# EasyEDA schematic SCH_CustomESP32Board_2024-06-23.json
TITLE: Sheet_1; REV: 1.0; Date: 2023-11-22; Sheet: 1/1; Drawn By: adammillion2006; Company: Your Company
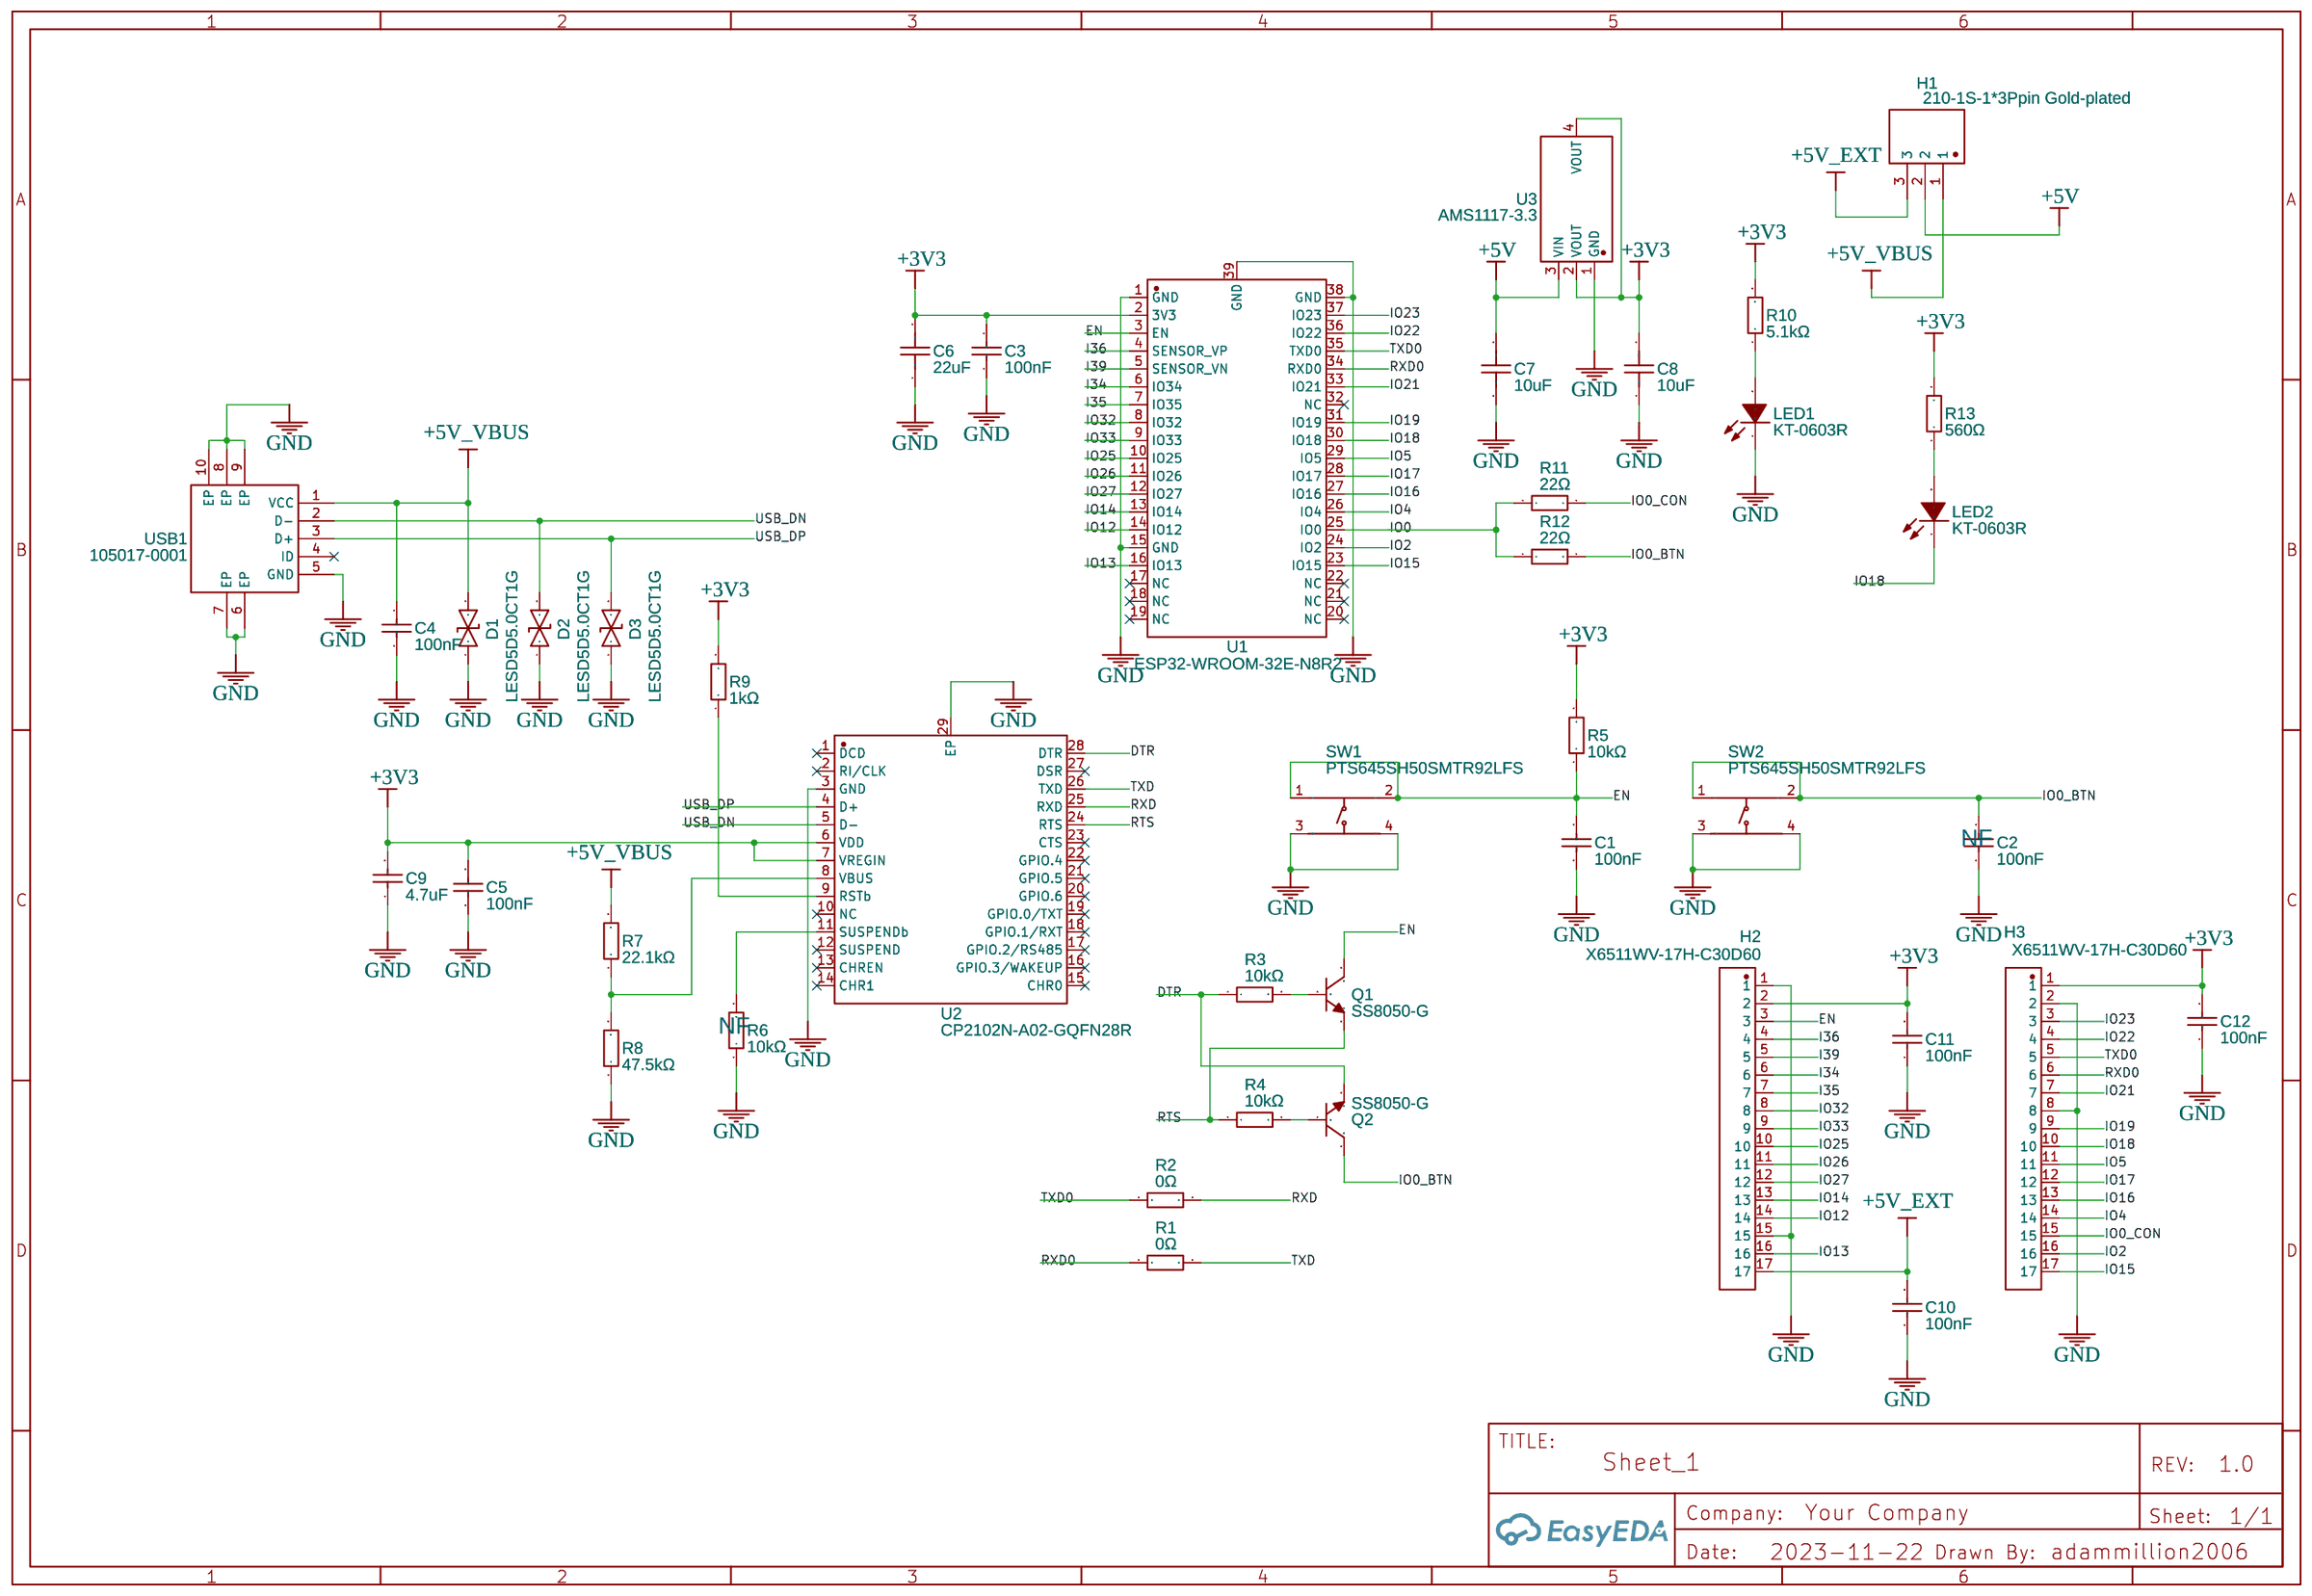
[diagram p0: schematic sheet]

## Parts
C1  100nF  [C0402]
C2  100nF  [C0402]
C3  100nF  [C0402]
C4  100nF  [C0402]
C5  100nF  [C0402]
C6  22uF  [C0805]
C7  10uF  [C0603]
C8  10uF  [C0603]
C9  4.7uF  [C0402]
C10  100nF  [C0402]
C11  100nF  [C0402]
C12  100nF  [C0402]
D1  LESD5D5.0CT1G  [SOD-523_L1.2-W0.8-LS1.6-BI]
D2  LESD5D5.0CT1G  [SOD-523_L1.2-W0.8-LS1.6-BI]
D3  LESD5D5.0CT1G  [SOD-523_L1.2-W0.8-LS1.6-BI]
H1  210-1S-1*3Ppin Gold-plated  [HDR-TH_3P-P1.27-V-M-1]
H2  X6511WV-17H-C30D60  [HDR-TH_17P-P2.54-V-M]
H3  X6511WV-17H-C30D60  [HDR-TH_17P-P2.54-V-M]
LED1  KT-0603R  [LED0603-RD]
LED2  KT-0603R  [LED0603-RD]
Q1  SS8050-G  [SOT-23-3_L2.9-W1.3-P1.90-LS2.4-BR]
Q2  SS8050-G  [SOT-23-3_L2.9-W1.3-P1.90-LS2.4-BR]
R1  0Ω  [R0402]
R2  0Ω  [R0402]
R3  10kΩ  [R0402]
R4  10kΩ  [R0402]
R5  10kΩ  [R0402]
R6  10kΩ  [R0402]
R7  22.1kΩ  [R0402]
R8  47.5kΩ  [R0402]
R9  1kΩ  [R0402]
R10  5.1kΩ  [R0402]
R11  22Ω  [R0402]
R12  22Ω  [R0402]
R13  560Ω  [R0402]
SW1  PTS645SH50SMTR92LFS  [KEY-SMD_4P-L6.0-W6.0-P4.50-LS9.0]
SW2  PTS645SH50SMTR92LFS  [KEY-SMD_4P-L6.0-W6.0-P4.50-LS9.0]
U1  ESP32-WROOM-32E-N8R2  [WIFI-SMD_ESP32-WROOM-32E]
U2  CP2102N-A02-GQFN28R  [QFN-28_L5.0-W5.0-P0.50-TL-EP3.3]
U3  AMS1117-3.3  [SOT-223-3_L6.5-W3.4-P2.30-LS7.0-BR]
USB1  105017-0001  [MICRO-USB-SMD_105017-0001]

## Library data of the parts
C1-C5 C10-C12 = CL05B104KO5NNNC: Supplier: LCSC; Manufacturer: SAMSUNG(三星); Supplier Part: C1525; JLCPCB Part Class: Basic Part; link: https://lcsc.com/eda_search?q=C1525&%26type=1&ref=editor
C6 = CL21A226MAQNNNE: Supplier: LCSC; Manufacturer: SAMSUNG(三星); Supplier Part: C45783; JLCPCB Part Class: Basic Part; link: https://lcsc.com/eda_search?q=C45783&%26type=1&ref=editor
C7 C8 = CL10A106KP8NNNC: Supplier: LCSC; Manufacturer: SAMSUNG(三星); Supplier Part: C19702; JLCPCB Part Class: Basic Part; link: https://lcsc.com/eda_search?q=C19702&%26type=1&ref=editor
C9 = CL05A475MP5NRNC: Supplier: LCSC; Manufacturer: SAMSUNG(三星); Supplier Part: C23733; JLCPCB Part Class: Basic Part; link: https://lcsc.com/eda_search?q=C23733&%26type=1&ref=editor
D1-D3 = LESD5D5.0CT1G: Contributor: LCSC; Supplier: LCSC; Supplier Part: C383211; Manufacturer: LRC(乐山无线电); JLCPCB Part Class: Extended Part; link: https://lcsc.com/eda_search?q=C383211&%26type=1&ref=editor
H1 = 210-1S-1*3Ppin Gold-plated: Contributor: LCSC; Supplier: LCSC; Manufacturer: Ckmtw(灿科盟); Manufacturer Part: B-2101S03P-A110; Supplier Part: C124354; JLCPCB Part Class: Extended Part; link: https://lcsc.com/eda_search?q=C124354&%26type=1&ref=editor
H2 H3 = X6511WV-17H-C30D60: Contributor: LCSC; Supplier: LCSC; Supplier Part: C725949; Manufacturer: XKB Connectivity(中国星坤); Manufacturer Part: X6511WV-17H-C60D30; JLCPCB Part Class: Extended Part; link: https://lcsc.com/eda_search?q=C725949&%26type=1&ref=editor
LED1 LED2 = KT-0603R: Supplier: LCSC; Manufacturer: KENTO; Supplier Part: C2286; JLCPCB Part Class: Basic Part; link: https://lcsc.com/eda_search?q=C2286&%26type=1&ref=editor
Q1 Q2 = SS8050-G: Contributor: LCSC; Supplier: LCSC; Manufacturer: CJ(江苏长电/长晶); Supplier Part: C164886; JLCPCB Part Class: Extended Part; link: https://lcsc.com/eda_search?q=C164886&%26type=1&ref=editor
R1 R2 = 0402WGF0000TCE: Supplier: LCSC; Manufacturer: UNI-ROYAL(厚声); Supplier Part: C17168; JLCPCB Part Class: Basic Part; link: https://lcsc.com/eda_search?q=C17168&%26type=1&ref=editor
R3-R6 = 0402WGF1002TCE: Supplier: LCSC; Manufacturer: UNI-ROYAL(厚声); Supplier Part: C25744; JLCPCB Part Class: Basic Part; link: https://lcsc.com/eda_search?q=C25744&%26type=1&ref=editor
R7 = 0402WGF2212TCE: Supplier: LCSC; Manufacturer: UNI-ROYAL(厚声); Supplier Part: C43473; JLCPCB Part Class: Extended Part; link: https://lcsc.com/eda_search?q=C43473&%26type=1&ref=editor
R8 = 0402WGF4752TCE: Supplier: LCSC; Manufacturer: UNI-ROYAL(厚声); Supplier Part: C25896; JLCPCB Part Class: Extended Part; link: https://lcsc.com/eda_search?q=C25896&%26type=1&ref=editor
R9 = 0402WGF1001TCE: Supplier: LCSC; Manufacturer: UNI-ROYAL(厚声); Supplier Part: C11702; JLCPCB Part Class: Basic Part; link: https://lcsc.com/eda_search?q=C11702&%26type=1&ref=editor
R10 = 0402WGF5101TCE: Supplier: LCSC; Manufacturer: UNI-ROYAL(厚声); Supplier Part: C25905; JLCPCB Part Class: Basic Part; link: https://lcsc.com/eda_search?q=C25905&%26type=1&ref=editor
R11 R12 = 0402WGF220JTCE: Supplier: LCSC; Manufacturer: UNI-ROYAL(厚声); Supplier Part: C25092; JLCPCB Part Class: Basic Part; link: https://lcsc.com/eda_search?q=C25092&%26type=1&ref=editor
R13 = 0402WGF5600TCE: Supplier: LCSC; Manufacturer: UNI-ROYAL(厚声); Supplier Part: C25126; JLCPCB Part Class: Extended Part; link: https://lcsc.com/eda_search?q=C25126&%26type=1&ref=editor
SW1 SW2 = PTS645SH50SMTR92LFS: Contributor: LCSC; Supplier: LCSC; Supplier Part: C221869; Manufacturer: C&K; JLCPCB Part Class: Extended Part; link: https://lcsc.com/eda_search?q=C221869&%26type=1&ref=editor
U1 = ESP32-WROOM-32E-N8R2: Supplier: LCSC; Supplier Part: C5361945; Manufacturer: ESPRESSIF(乐鑫); JLCPCB Part Class: Extended Part; Contributor: lcsc; link: https://lcsc.com/eda_search?q=C5361945&%26type=1&ref=editor
U2 = CP2102N-A02-GQFN28R: Contributor: LCSC; Supplier: LCSC; Supplier Part: C964632; Manufacturer: SILICON LABS(芯科); JLCPCB Part Class: Extended Part; link: https://lcsc.com/eda_search?q=C964632&%26type=1&ref=editor
U3 = AMS1117-3.3: sourceId: dwIGgezVh; Supplier: LCSC; Manufacturer: AMS; Supplier Part: C6186; JLCPCB Part Class: Basic Part; link: https://lcsc.com/eda_search?q=C6186&%26type=1&ref=editor
USB1 = 105017-0001: Contributor: LCSC; Supplier: LCSC; Manufacturer: MOLEX; Manufacturer Part: 1050170001; Supplier Part: C136000; JLCPCB Part Class: Extended Part; link: https://lcsc.com/eda_search?q=C136000&%26type=1&ref=editor

## Nets
+3V3: C3.2 C5.2 C6.2 C8.2 C9.2 C11.2 C12.2 H2.2 H3.1 R5.2 R9.2 R10.2 R13.2 U1.2(3V3) U2.6(VDD) U2.7(VREGIN) U3.2(VOUT) U3.4(VOUT)
+5V: C7.2 H1.2 U3.3(VIN)
+5V_EXT: C10.2 H1.3 H2.17
+5V_VBUS: C4.2 D1.2 H1.1 R7.2 USB1.1(VCC)
GND: C1.1 C2.1 C3.1 C4.1 C5.1 C6.1 C7.1 C8.1 C9.1 C10.1 C11.1 C12.1 D1.1 D2.1 D3.1 H2.1 H2.15 H3.2 H3.8 LED1.1(K) R6.1 R8.1 SW1.3 SW1.4 SW2.3 SW2.4 U1.1(GND) U1.15(GND) U1.38(GND) U1.39(GND) U2.3(GND) U2.29(EP) U3.1(GND) USB1.5(GND) USB1.6(EP) USB1.7(EP) USB1.8(EP) USB1.9(EP) USB1.10(EP)
DTR: Q2.2(E) R3.1 U2.28(DTR)
EN: C1.2 H2.3 Q1.3(C) R5.1 SW1.1 SW1.2 U1.3(EN)
I34: H2.6 U1.6(IO34)
I35: H2.7 U1.7(IO35)
I36: H2.4 U1.4(SENSOR_VP)
I39: H2.5 U1.5(SENSOR_VN)
IO0: R11.1 R12.1 U1.25(IO0)
IO0_BTN: C2.2 Q2.3(C) R12.2 SW2.1 SW2.2
IO0_CON: H3.15 R11.2
IO2: H3.16 U1.24(IO2)
IO4: H3.14 U1.26(IO4)
IO5: H3.11 U1.29(IO5)
IO12: H2.14 U1.14(IO12)
IO13: H2.16 U1.16(IO13)
IO14: H2.13 U1.13(IO14)
IO15: H3.17 U1.23(IO15)
IO16: H3.13 U1.27(IO16)
IO17: H3.12 U1.28(IO17)
IO18: H3.10 LED2.1(K) U1.30(IO18)
IO19: H3.9 U1.31(IO19)
IO21: H3.7 U1.33(IO21)
IO22: H3.4 U1.36(IO22)
IO23: H3.3 U1.37(IO23)
IO25: H2.10 U1.10(IO25)
IO26: H2.11 U1.11(IO26)
IO27: H2.12 U1.12(IO27)
IO32: H2.8 U1.8(IO32)
IO33: H2.9 U1.9(IO33)
RTS: Q1.2(E) R4.1 U2.24(RTS)
RXD: R2.2 U2.25(RXD)
RXD0: H3.6 R1.1 U1.34(RXD0)
TXD: R1.2 U2.26(TXD)
TXD0: H3.5 R2.1 U1.35(TXD0)
USB_DN: D2.2 U2.5(D-) USB1.2(D-)
USB_DP: D3.2 U2.4(D+) USB1.3(D+)
Net-(LED1-2): LED1.2(A) R10.1
Net-(LED2-2): LED2.2(A) R13.1
Net-(Q1-1): Q1.1(B) R3.2
Net-(Q2-1): Q2.1(B) R4.2
Net-(R6-2): R6.2 U2.11(SUSPENDb)
Net-(R7-1): R7.1 R8.2 U2.8(VBUS)
Net-(R9-1): R9.1 U2.9(RSTb)

Not connected (* = marked no-connect by the designer): U1 17(NC)* 18(NC)* 19(NC)* 20(NC)* 21(NC)* 22(NC)* 32(NC)*; U2 1(DCD)* 2(RI/CLK)* 10(NC)* 12(SUSPEND)* 13(CHREN)* 14(CHR1)* 15(CHR0)* 16(GPIO.3/WAKEUP)* 17(GPIO.2/RS485)* 18(GPIO.1/RXT)* 19(GPIO.0/TXT)* 20(GPIO.6)* 21(GPIO.5)* 22(GPIO.4)* 23(CTS)* 27(DSR)*; USB1 4(ID)*

## Notes on the sheet
- NF
- NF
